# Altium schematic sheet meow-65.SchDoc
size A3; SheetNumber: 1; SheetTotal: 1
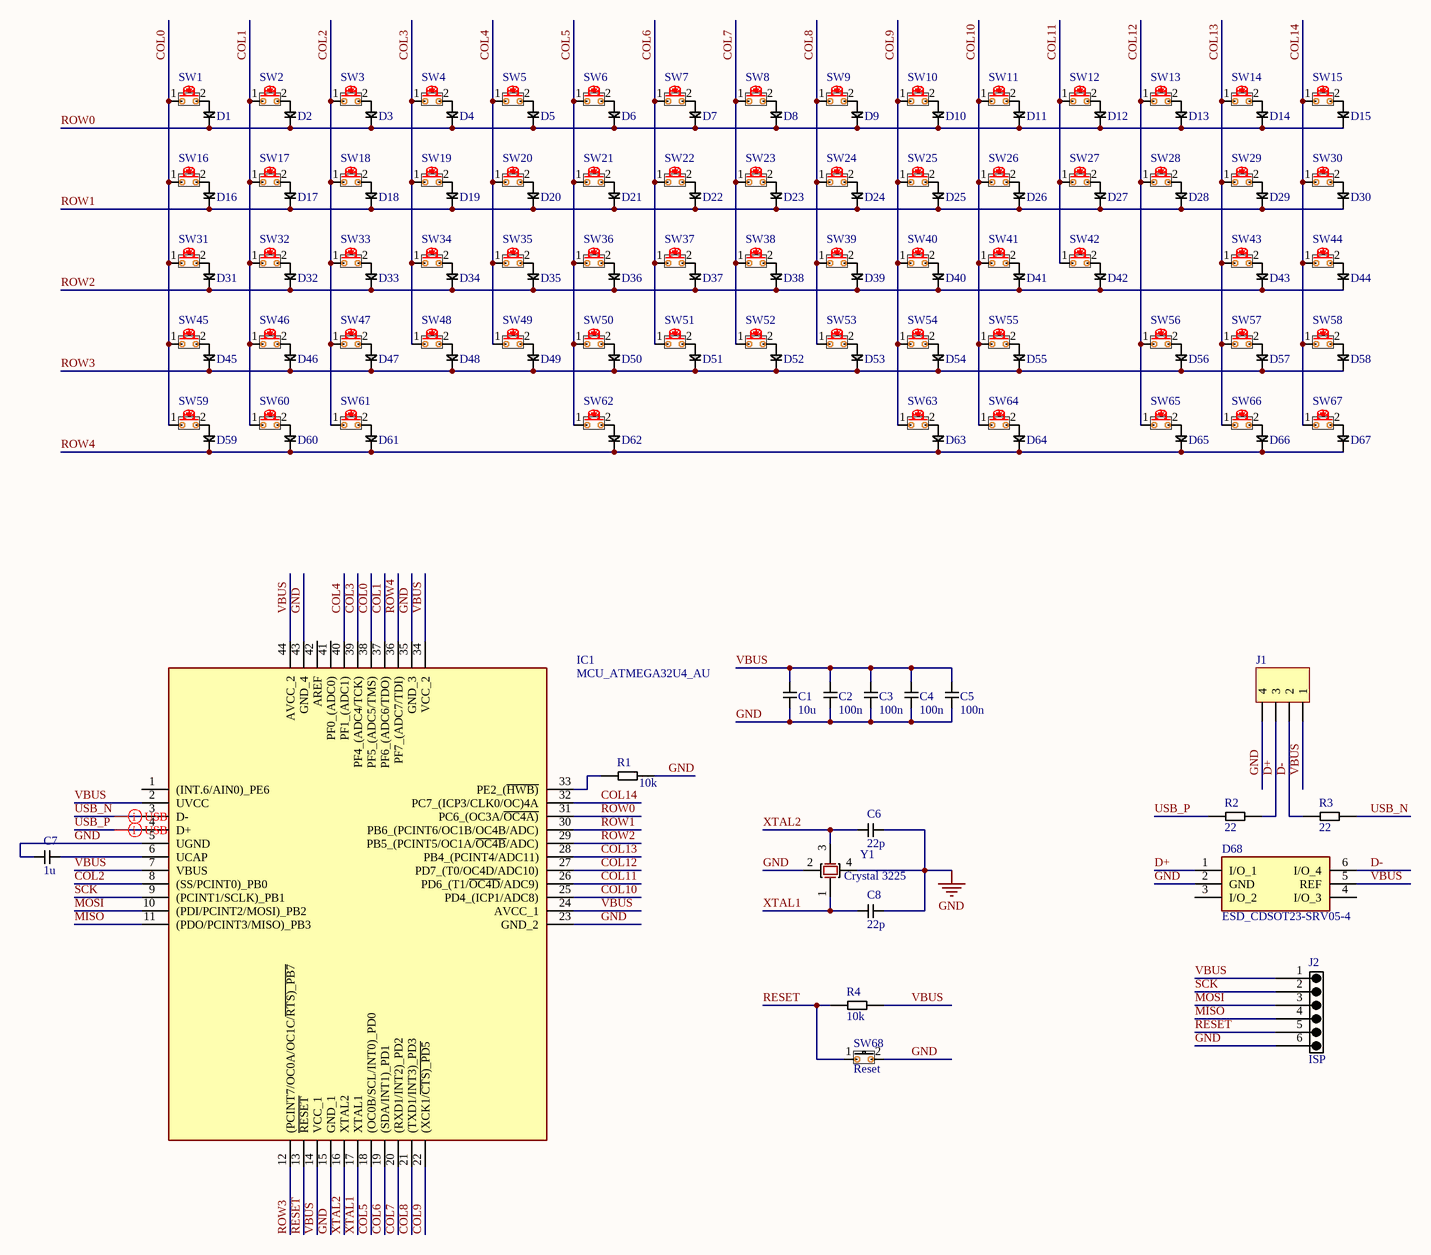
[diagram p0: meow-65.SchDoc]

## Parts
C1  10u  [CAP_0805]
C2  100n  [CAP_0805]
C3  100n  [CAP_0805]
C4  100n  [CAP_0805]
C5  100n  [CAP_0805]
C6  22p  [CAP_0805]
C7  1u  [CAP_0805]
C8  22p  [CAP_0805]
D1  1N4148_SOD123  [SOD123]  (value not drawn)
D2  1N4148_SOD123  [SOD123]  (value not drawn)
D3  1N4148_SOD123  [SOD123]  (value not drawn)
D4  1N4148_SOD123  [SOD123]  (value not drawn)
D5  1N4148_SOD123  [SOD123]  (value not drawn)
D6  1N4148_SOD123  [SOD123]  (value not drawn)
D7  1N4148_SOD123  [SOD123]  (value not drawn)
D8  1N4148_SOD123  [SOD123]  (value not drawn)
D9  1N4148_SOD123  [SOD123]  (value not drawn)
D10  1N4148_SOD123  [SOD123]  (value not drawn)
D11  1N4148_SOD123  [SOD123]  (value not drawn)
D12  1N4148_SOD123  [SOD123]  (value not drawn)
D13  1N4148_SOD123  [SOD123]  (value not drawn)
D14  1N4148_SOD123  [SOD123]  (value not drawn)
D15  1N4148_SOD123  [SOD123]  (value not drawn)
D16  1N4148_SOD123  [SOD123]  (value not drawn)
D17  1N4148_SOD123  [SOD123]  (value not drawn)
D18  1N4148_SOD123  [SOD123]  (value not drawn)
D19  1N4148_SOD123  [SOD123]  (value not drawn)
D20  1N4148_SOD123  [SOD123]  (value not drawn)
D21  1N4148_SOD123  [SOD123]  (value not drawn)
D22  1N4148_SOD123  [SOD123]  (value not drawn)
D23  1N4148_SOD123  [SOD123]  (value not drawn)
D24  1N4148_SOD123  [SOD123]  (value not drawn)
D25  1N4148_SOD123  [SOD123]  (value not drawn)
D26  1N4148_SOD123  [SOD123]  (value not drawn)
D27  1N4148_SOD123  [SOD123]  (value not drawn)
D28  1N4148_SOD123  [SOD123]  (value not drawn)
D29  1N4148_SOD123  [SOD123]  (value not drawn)
D30  1N4148_SOD123  [SOD123]  (value not drawn)
D31  1N4148_SOD123  [SOD123]  (value not drawn)
D32  1N4148_SOD123  [SOD123]  (value not drawn)
D33  1N4148_SOD123  [SOD123]  (value not drawn)
D34  1N4148_SOD123  [SOD123]  (value not drawn)
D35  1N4148_SOD123  [SOD123]  (value not drawn)
D36  1N4148_SOD123  [SOD123]  (value not drawn)
D37  1N4148_SOD123  [SOD123]  (value not drawn)
D38  1N4148_SOD123  [SOD123]  (value not drawn)
D39  1N4148_SOD123  [SOD123]  (value not drawn)
D40  1N4148_SOD123  [SOD123]  (value not drawn)
D41  1N4148_SOD123  [SOD123]  (value not drawn)
D42  1N4148_SOD123  [SOD123]  (value not drawn)
D43  1N4148_SOD123  [SOD123]  (value not drawn)
D44  1N4148_SOD123  [SOD123]  (value not drawn)
D45  1N4148_SOD123  [SOD123]  (value not drawn)
D46  1N4148_SOD123  [SOD123]  (value not drawn)
D47  1N4148_SOD123  [SOD123]  (value not drawn)
D48  1N4148_SOD123  [SOD123]  (value not drawn)
D49  1N4148_SOD123  [SOD123]  (value not drawn)
D50  1N4148_SOD123  [SOD123]  (value not drawn)
D51  1N4148_SOD123  [SOD123]  (value not drawn)
D52  1N4148_SOD123  [SOD123]  (value not drawn)
D53  1N4148_SOD123  [SOD123]  (value not drawn)
D54  1N4148_SOD123  [SOD123]  (value not drawn)
D55  1N4148_SOD123  [SOD123]  (value not drawn)
D56  1N4148_SOD123  [SOD123]  (value not drawn)
D57  1N4148_SOD123  [SOD123]  (value not drawn)
D58  1N4148_SOD123  [SOD123]  (value not drawn)
D59  1N4148_SOD123  [SOD123]  (value not drawn)
D60  1N4148_SOD123  [SOD123]  (value not drawn)
D61  1N4148_SOD123  [SOD123]  (value not drawn)
D62  1N4148_SOD123  [SOD123]  (value not drawn)
D63  1N4148_SOD123  [SOD123]  (value not drawn)
D64  1N4148_SOD123  [SOD123]  (value not drawn)
D65  1N4148_SOD123  [SOD123]  (value not drawn)
D66  1N4148_SOD123  [SOD123]  (value not drawn)
D67  1N4148_SOD123  [SOD123]  (value not drawn)
D68  ESD_CDSOT23-SRV05-4  [SOT23_6]
IC1  MCU_ATMEGA32U4_AU  [44-TQFP]
J1  SM04B-SRSS-TB(LF)(SN)  [JP_1.0_4P]  (value not drawn)
J2  ISP  [JP_2.54_6P_NoJump]
R1  10k  [RES_0805]
R2  22  [RES_0805]
R3  22  [RES_0805]
R4  10k  [RES_0805]
SW1  MX_HS  [MX_HS]  (value not drawn)
SW2  MX_HS  [MX_HS]  (value not drawn)
SW3  MX_HS  [MX_HS]  (value not drawn)
SW4  MX_HS  [MX_HS]  (value not drawn)
SW5  MX_HS  [MX_HS]  (value not drawn)
SW6  MX_HS  [MX_HS]  (value not drawn)
SW7  MX_HS  [MX_HS]  (value not drawn)
SW8  MX_HS  [MX_HS]  (value not drawn)
SW9  MX_HS  [MX_HS]  (value not drawn)
SW10  MX_HS  [MX_HS]  (value not drawn)
SW11  MX_HS  [MX_HS]  (value not drawn)
SW12  MX_HS  [MX_HS]  (value not drawn)
SW13  MX_HS  [MX_HS]  (value not drawn)
SW14  MX_HS_2U  [MX_HS_2U]  (value not drawn)
SW15  MX_HS  [MX_HS]  (value not drawn)
SW16  MX_HS  [MX_HS]  (value not drawn)
SW17  MX_HS  [MX_HS]  (value not drawn)
SW18  MX_HS  [MX_HS]  (value not drawn)
SW19  MX_HS  [MX_HS]  (value not drawn)
SW20  MX_HS  [MX_HS]  (value not drawn)
SW21  MX_HS  [MX_HS]  (value not drawn)
SW22  MX_HS  [MX_HS]  (value not drawn)
SW23  MX_HS  [MX_HS]  (value not drawn)
SW24  MX_HS  [MX_HS]  (value not drawn)
SW25  MX_HS  [MX_HS]  (value not drawn)
SW26  MX_HS  [MX_HS]  (value not drawn)
SW27  MX_HS  [MX_HS]  (value not drawn)
SW28  MX_HS  [MX_HS]  (value not drawn)
SW29  MX_HS  [MX_HS]  (value not drawn)
SW30  MX_HS  [MX_HS]  (value not drawn)
SW31  MX_HS  [MX_HS]  (value not drawn)
SW32  MX_HS  [MX_HS]  (value not drawn)
SW33  MX_HS  [MX_HS]  (value not drawn)
SW34  MX_HS  [MX_HS]  (value not drawn)
SW35  MX_HS  [MX_HS]  (value not drawn)
SW36  MX_HS  [MX_HS]  (value not drawn)
SW37  MX_HS  [MX_HS]  (value not drawn)
SW38  MX_HS  [MX_HS]  (value not drawn)
SW39  MX_HS  [MX_HS]  (value not drawn)
SW40  MX_HS  [MX_HS]  (value not drawn)
SW41  MX_HS  [MX_HS]  (value not drawn)
SW42  MX_HS  [MX_HS]  (value not drawn)
SW43  MX_HS_2U  [MX_HS_2U]  (value not drawn)
SW44  MX_HS  [MX_HS]  (value not drawn)
SW45  MX_HS_2U  [MX_HS_2U]  (value not drawn)
SW46  MX_HS  [MX_HS]  (value not drawn)
SW47  MX_HS  [MX_HS]  (value not drawn)
SW48  MX_HS  [MX_HS]  (value not drawn)
SW49  MX_HS  [MX_HS]  (value not drawn)
SW50  MX_HS  [MX_HS]  (value not drawn)
SW51  MX_HS  [MX_HS]  (value not drawn)
SW52  MX_HS  [MX_HS]  (value not drawn)
SW53  MX_HS  [MX_HS]  (value not drawn)
SW54  MX_HS  [MX_HS]  (value not drawn)
SW55  MX_HS  [MX_HS]  (value not drawn)
SW56  MX_HS  [MX_HS]  (value not drawn)
SW57  MX_HS  [MX_HS]  (value not drawn)
SW58  MX_HS  [MX_HS]  (value not drawn)
SW59  MX_HS  [MX_HS]  (value not drawn)
SW60  MX_HS  [MX_HS]  (value not drawn)
SW61  MX_HS  [MX_HS]  (value not drawn)
SW62  MX_HS_6.25u  [MX_HS_6.25U]  (value not drawn)
SW63  MX_HS  [MX_HS]  (value not drawn)
SW64  MX_HS  [MX_HS]  (value not drawn)
SW65  MX_HS  [MX_HS]  (value not drawn)
SW66  MX_HS  [MX_HS]  (value not drawn)
SW67  MX_HS  [MX_HS]  (value not drawn)
SW68  Reset  [SW_5.2MM]
Y1  Crystal 3225  [Crystal-3225]

## Nets
GND: C1.1 C2.1 C3.1 C4.1 C5.1 C6.2 C7.1 C8.2 D68.2(GND) IC1.5(UGND) IC1.15(GND_1) IC1.23(GND_2) IC1.35(GND_3) IC1.43(GND_4) J1.4 J2.6 R1.2 SW68.2 Y1.2 Y1.4
COL0: IC1.38(PF5_(ADC5/TMS)) SW1.1 SW16.1 SW31.1 SW45.1 SW59.1
COL1: IC1.37(PF6_(ADC6/TDO)) SW2.1 SW17.1 SW32.1 SW46.1 SW60.1
COL2: IC1.8((SS/PCINT0)_PB0) SW3.1 SW18.1 SW33.1 SW47.1 SW61.1
COL3: IC1.39(PF4_(ADC4/TCK)) SW4.1 SW19.1 SW34.1 SW48.1
COL4: IC1.40(PF1_(ADC1)) SW5.1 SW20.1 SW35.1 SW49.1
COL5: IC1.18((OC0B/SCL/INT0)_PD0) SW6.1 SW21.1 SW36.1 SW50.1 SW62.1
COL6: IC1.19((SDA/INT1)_PD1) SW7.1 SW22.1 SW37.1 SW51.1
COL7: IC1.20((RXD1/INT2)_PD2) SW8.1 SW23.1 SW38.1 SW52.1
COL8: IC1.21((TXD1/INT3)_PD3) SW9.1 SW24.1 SW39.1 SW53.1
COL9: IC1.22((XCK1/~{CTS)_PD5}) SW10.1 SW25.1 SW40.1 SW54.1 SW63.1
COL10: IC1.25(PD4_(ICP1/ADC8)) SW11.1 SW26.1 SW41.1 SW55.1 SW64.1
COL11: IC1.26(PD6_(T1/~{OC4D}/ADC9)) SW12.1 SW27.1 SW42.1
COL12: IC1.27(PD7_(T0/OC4D/ADC10)) SW13.1 SW28.1 SW56.1 SW65.1
COL13: IC1.28(PB4_(PCINT4/ADC11)) SW14.1 SW29.1 SW43.1 SW57.1 SW66.1
COL14: IC1.32(PC7_(ICP3/CLK0/OC)4A) SW15.1 SW30.1 SW44.1 SW58.1 SW67.1
D+: D68.1(I/O_1) J1.3 R2.2
D-: D68.6(I/O_4) J1.2 R3.1
MISO: IC1.11((PDO/PCINT3/MISO)_PB3) J2.4
MOSI: IC1.10((PDI/PCINT2/MOSI)_PB2) J2.3
RESET: IC1.13(~{RESET}) J2.5 R4.1 SW68.1
ROW0: D1.2 D2.2 D3.2 D4.2 D5.2 D6.2 D7.2 D8.2 D9.2 D10.2 D11.2 D12.2 D13.2 D14.2 D15.2 IC1.31(PC6_(OC3A/~{OC4A)})
ROW1: D16.2 D17.2 D18.2 D19.2 D20.2 D21.2 D22.2 D23.2 D24.2 D25.2 D26.2 D27.2 D28.2 D29.2 D30.2 IC1.30(PB6_(PCINT6/OC1B/OC4B/ADC))
ROW2: D31.2 D32.2 D33.2 D34.2 D35.2 D36.2 D37.2 D38.2 D39.2 D40.2 D41.2 D42.2 D43.2 D44.2 IC1.29(PB5_(PCINT5/OC1A/~{OC4B}/ADC))
ROW3: D45.2 D46.2 D47.2 D48.2 D49.2 D50.2 D51.2 D52.2 D53.2 D54.2 D55.2 D56.2 D57.2 D58.2 IC1.12((PCINT7/OC0A/OC1C/~{RTS)_PB7})
ROW4: D59.2 D60.2 D61.2 D62.2 D63.2 D64.2 D65.2 D66.2 D67.2 IC1.36(PF7_(ADC7/TDI))
SCK: IC1.9((PCINT1/SCLK)_PB1) J2.2
USB_N: IC1.3(D-) R3.2
USB_P: IC1.4(D+) R2.1
VBUS: C1.2 C2.2 C3.2 C4.2 C5.2 D68.5(REF) IC1.2(UVCC) IC1.7(VBUS) IC1.14(VCC_1) IC1.24(AVCC_1) IC1.34(VCC_2) IC1.44(AVCC_2) J1.1 J2.1 R4.2
XTAL1: C8.1 IC1.17(XTAL1) Y1.1
XTAL2: C6.1 IC1.16(XTAL2) Y1.3
NetC7_2: C7.2 IC1.6(UCAP)
NetD1_1: D1.1(+) SW1.2
NetD2_1: D2.1(+) SW2.2
NetD3_1: D3.1(+) SW3.2
NetD4_1: D4.1(+) SW4.2
NetD5_1: D5.1(+) SW5.2
NetD6_1: D6.1(+) SW6.2
NetD7_1: D7.1(+) SW7.2
NetD8_1: D8.1(+) SW8.2
NetD9_1: D9.1(+) SW9.2
NetD10_1: D10.1(+) SW10.2
NetD11_1: D11.1(+) SW11.2
NetD12_1: D12.1(+) SW12.2
NetD13_1: D13.1(+) SW13.2
NetD14_1: D14.1(+) SW14.2
NetD15_1: D15.1(+) SW15.2
NetD16_1: D16.1(+) SW16.2
NetD17_1: D17.1(+) SW17.2
NetD18_1: D18.1(+) SW18.2
NetD19_1: D19.1(+) SW19.2
NetD20_1: D20.1(+) SW20.2
NetD21_1: D21.1(+) SW21.2
NetD22_1: D22.1(+) SW22.2
NetD23_1: D23.1(+) SW23.2
NetD24_1: D24.1(+) SW24.2
NetD25_1: D25.1(+) SW25.2
NetD26_1: D26.1(+) SW26.2
NetD27_1: D27.1(+) SW27.2
NetD28_1: D28.1(+) SW28.2
NetD29_1: D29.1(+) SW29.2
NetD30_1: D30.1(+) SW30.2
NetD31_1: D31.1(+) SW31.2
NetD32_1: D32.1(+) SW32.2
NetD33_1: D33.1(+) SW33.2
NetD34_1: D34.1(+) SW34.2
NetD35_1: D35.1(+) SW35.2
NetD36_1: D36.1(+) SW36.2
NetD37_1: D37.1(+) SW37.2
NetD38_1: D38.1(+) SW38.2
NetD39_1: D39.1(+) SW39.2
NetD40_1: D40.1(+) SW40.2
NetD41_1: D41.1(+) SW41.2
NetD42_1: D42.1(+) SW42.2
NetD43_1: D43.1(+) SW43.2
NetD44_1: D44.1(+) SW44.2
NetD45_1: D45.1(+) SW45.2
NetD46_1: D46.1(+) SW46.2
NetD47_1: D47.1(+) SW47.2
NetD48_1: D48.1(+) SW48.2
NetD49_1: D49.1(+) SW49.2
NetD50_1: D50.1(+) SW50.2
NetD51_1: D51.1(+) SW51.2
NetD52_1: D52.1(+) SW52.2
NetD53_1: D53.1(+) SW53.2
NetD54_1: D54.1(+) SW54.2
NetD55_1: D55.1(+) SW55.2
NetD56_1: D56.1(+) SW56.2
NetD57_1: D57.1(+) SW57.2
NetD58_1: D58.1(+) SW58.2
NetD59_1: D59.1(+) SW59.2
NetD60_1: D60.1(+) SW60.2
NetD61_1: D61.1(+) SW61.2
NetD62_1: D62.1(+) SW62.2
NetD63_1: D63.1(+) SW63.2
NetD64_1: D64.1(+) SW64.2
NetD65_1: D65.1(+) SW65.2
NetD66_1: D66.1(+) SW66.2
NetD67_1: D67.1(+) SW67.2
NetIC1_33: IC1.33(PE2_(~{HWB)}) R1.1

Not connected (* = marked no-connect by the designer): D68 3(I/O_2) 4(I/O_3); IC1 1((INT.6/AIN0)_PE6) 41(PF0_(ADC0)) 42(AREF)

## Layout directives
differential pair: USB_N, USB_P

## Library data of the parts
C1-C8 = CAP_0805
J1 = JP_1.0_4P
J2 = JP_2.54_6P_NoJump
R1-R4 = RES_0805
SW68 = SW_5.2mm